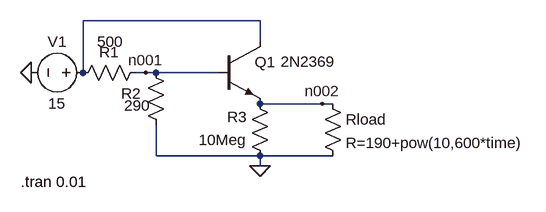
[diagram p0: schematic c02ex05s02.asc]
c02ex05s02.asc, the LTspice schematic file:
Version 4
SHEET 1 1068 680
WIRE 400 64 128 64
WIRE 400 96 400 64
WIRE 128 144 128 64
WIRE 224 144 208 144
WIRE 240 144 224 144
WIRE 336 144 240 144
WIRE 496 192 400 192
WIRE 512 192 496 192
WIRE 240 272 240 224
WIRE 400 272 240 272
WIRE 512 272 400 272
WIRE 400 288 400 272
FLAG 48 144 0
FLAG 400 288 0
FLAG 224 144 n001
FLAG 496 192 n002
SYMBOL voltage 144 144 R90
WINDOW 0 -32 56 VBottom 2
WINDOW 3 32 56 VTop 2
WINDOW 123 0 0 Left 0
WINDOW 39 0 0 Left 0
SYMATTR InstName V1
SYMATTR Value 15
SYMBOL res 224 128 R90
WINDOW 0 0 56 VBottom 2
WINDOW 3 -47 54 VTop 2
SYMATTR InstName R1
SYMATTR Value 500
SYMBOL res 256 240 R180
WINDOW 0 39 64 Left 2
WINDOW 3 24 45 Left 2
SYMATTR InstName R2
SYMATTR Value 290
SYMBOL res 416 288 R180
WINDOW 0 36 76 Left 2
WINDOW 3 36 40 Left 2
SYMATTR InstName R3
SYMATTR Value 10Meg
SYMBOL res 496 176 R0
SYMATTR InstName Rload
SYMATTR Value R=190+pow(10,600*time)
SYMBOL npn 336 96 R0
WINDOW 3 96 31 Left 2
SYMATTR Value 2N2369
SYMATTR InstName Q1
TEXT 32 312 Left 2 !.tran 0.01

The netlist it stands for:
* c02ex05s02.asc
V1 N003 0 15
R1 n001 N003 500
R2 0 n001 290
R3 0 n002 10Meg
Rload n002 0 R=190+pow(10,600*time)
Q1 N003 n001 n002 0 2N2369
.model NPN NPN
.model PNP PNP
.lib standard.bjt
.tran 0.01
.backanno
.end